# Altium schematic sheet Controller-RK3562-TOP.SchDoc
size A2; SheetNumber: 1; SheetTotal: 32
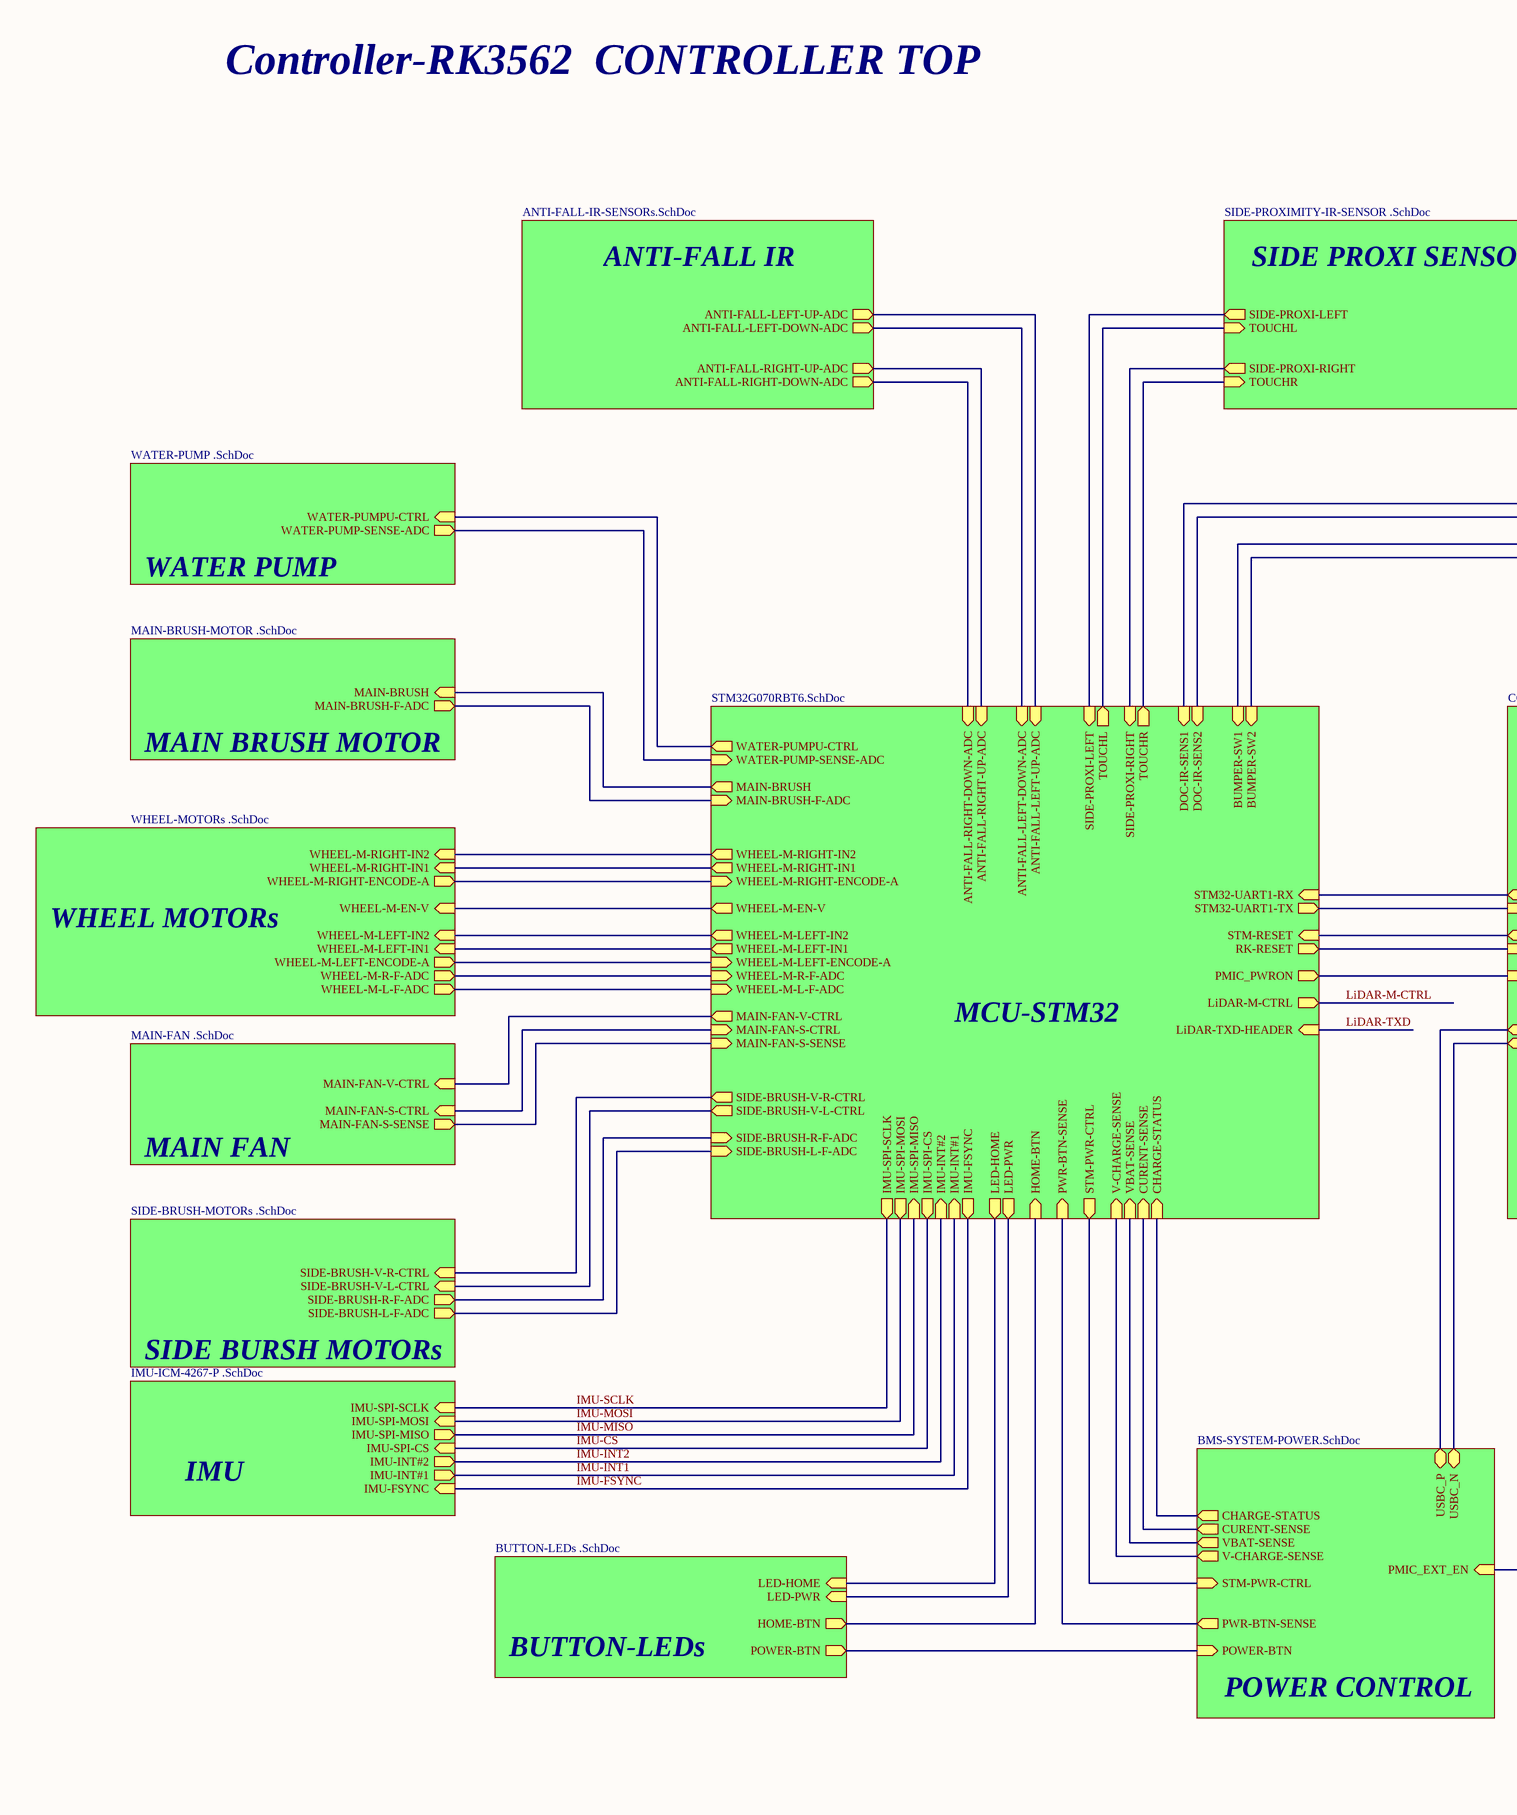
[diagram p0: Controller-RK3562-TOP.SchDoc, left]
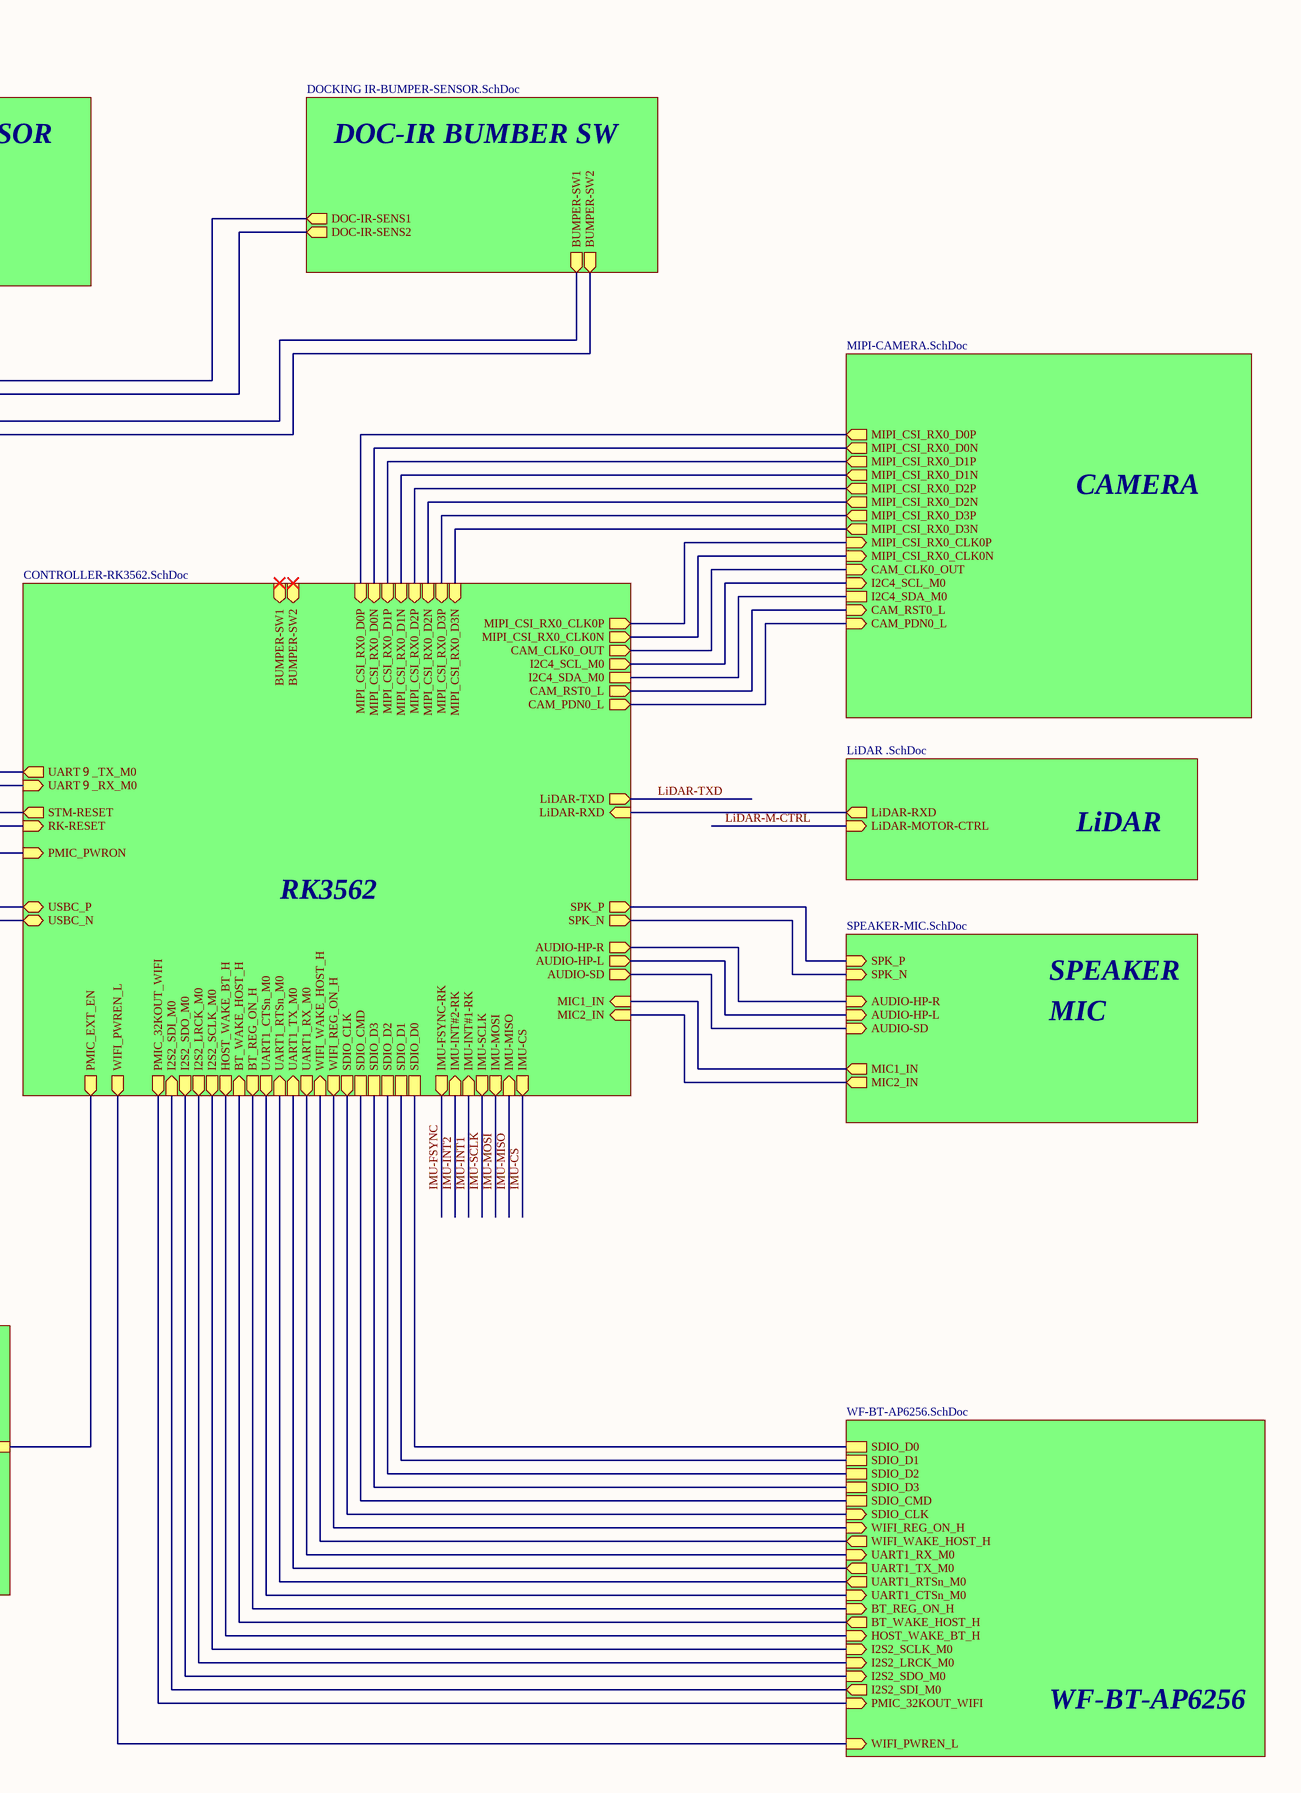
[diagram p1: Controller-RK3562-TOP.SchDoc, right]

## Sub-sheets
ANTI-FALL = ANTI-FALL-IR-SENSORs.SchDoc: ANTI-FALL-LEFT-UP-ADC (out), ANTI-FALL-LEFT-DOWN-ADC (out), ANTI-FALL-RIGHT-UP-ADC (out), ANTI-FALL-RIGHT-DOWN-ADC (out)
BUTTON-LED = BUTTON-LEDs .SchDoc: LED-HOME (in), LED-PWR (in), HOME-BTN (out), POWER-BTN (out)
CAMERA = MIPI-CAMERA.SchDoc: MIPI_CSI_RX0_D0P (out), MIPI_CSI_RX0_D0N (out), MIPI_CSI_RX0_D1P (out), MIPI_CSI_RX0_D1N (out), MIPI_CSI_RX0_D2P (out), MIPI_CSI_RX0_D2N (out), MIPI_CSI_RX0_D3P (out), MIPI_CSI_RX0_D3N (out), CAM_CLK0_OUT (in), I2C4_SCL_M0 (in), I2C4_SDA_M0, CAM_RST0_L (in), CAM_PDN0_L (in), MIPI_CSI_RX0_CLK0P (in), MIPI_CSI_RX0_CLK0N (in)
DOCKING-BUMBER = DOCKING IR-BUMPER-SENSOR.SchDoc: DOC-IR-SENS1 (out), DOC-IR-SENS2 (out), BUMPER-SW1 (out), BUMPER-SW2 (out)
IMU = IMU-ICM-4267-P .SchDoc: IMU-SPI-SCLK (in), IMU-SPI-MOSI (in), IMU-SPI-MISO (out), IMU-SPI-CS (in), IMU-INT#2 (out), IMU-INT#1 (out), IMU-FSYNC (in)
LiDAR = LiDAR .SchDoc: LiDAR-MOTOR-CTRL (in), LiDAR-RXD (out)
MAIN-BRUSH MOTOR = MAIN-BRUSH-MOTOR .SchDoc: MAIN-BRUSH (in), MAIN-BRUSH-F-ADC (out)
MAIN-FAN = MAIN-FAN .SchDoc: MAIN-FAN-V-CTRL (in), MAIN-FAN-S-CTRL (in), MAIN-FAN-S-SENSE (out)
MCU-STM32 = STM32G070RBT6.SchDoc: WATER-PUMPU-CTRL (out), MAIN-BRUSH (out), WHEEL-M-RIGHT-IN2 (out), WHEEL-M-RIGHT-IN1 (out), WHEEL-M-RIGHT-ENCODE-A (in), WHEEL-M-LEFT-IN2 (out), WHEEL-M-LEFT-IN1 (out), WHEEL-M-LEFT-ENCODE-A (in), WHEEL-M-EN-V (out), MAIN-FAN-V-CTRL (out), MAIN-FAN-S-CTRL (in), MAIN-FAN-S-SENSE (in), SIDE-BRUSH-V-R-CTRL (out), SIDE-BRUSH-V-L-CTRL (out), DOC-IR-SENS1 (in), DOC-IR-SENS2 (in), ANTI-FALL-LEFT-UP-ADC (in), ANTI-FALL-LEFT-DOWN-ADC (in), ANTI-FALL-RIGHT-UP-ADC (in), ANTI-FALL-RIGHT-DOWN-ADC (in), SIDE-PROXI-LEFT (in), TOUCHL (out), SIDE-PROXI-RIGHT (in), TOUCHR (out), LED-HOME (out), LED-PWR (out), HOME-BTN (in), CHARGE-STATUS (in), CURENT-SENSE (in), VBAT-SENSE (in), STM-RESET (in), STM32-UART1-TX (out), STM32-UART1-RX (in), WATER-PUMP-SENSE-ADC (in), MAIN-BRUSH-F-ADC (in), WHEEL-M-R-F-ADC (in), WHEEL-M-L-F-ADC (in), SIDE-BRUSH-R-F-ADC (in), SIDE-BRUSH-L-F-ADC (in), STM-PWR-CTRL (out), PWR-BTN-SENSE (in), PMIC_PWRON (out), RK-RESET (out), V-CHARGE-SENSE (in), LiDAR-M-CTRL (out), IMU-SPI-SCLK (out), IMU-SPI-MOSI (out), IMU-SPI-MISO (in), IMU-SPI-CS (out), IMU-INT#2 (in), IMU-INT#1 (in), IMU-FSYNC (out), LiDAR-TXD-HEADER (in), BUMPER-SW1 (in), BUMPER-SW2 (in)
POWER = BMS-SYSTEM-POWER.SchDoc: CHARGE-STATUS (out), CURENT-SENSE (out), VBAT-SENSE (out), POWER-BTN (in), USBC_P (bidir), USBC_N (bidir), PMIC_EXT_EN (in), STM-PWR-CTRL (in), PWR-BTN-SENSE (out), V-CHARGE-SENSE (out)
RK3562 = CONTROLLER-RK3562.SchDoc: MIPI_CSI_RX0_CLK0P (out), MIPI_CSI_RX0_CLK0N (out), I2C4_SCL_M0 (out), I2C4_SDA_M0, CAM_RST0_L (out), CAM_PDN0_L (out), MIPI_CSI_RX0_D3N (in), MIPI_CSI_RX0_D3P (in), MIPI_CSI_RX0_D2N (in), MIPI_CSI_RX0_D2P (in), MIPI_CSI_RX0_D1N (in), MIPI_CSI_RX0_D1P (in), MIPI_CSI_RX0_D0N (in), MIPI_CSI_RX0_D0P (in), CAM_CLK0_OUT (out), LiDAR-RXD (in), AUDIO-HP-L (out), AUDIO-SD (out), MIC1_IN (in), MIC2_IN (in), IMU-INT#1-RK (in), IMU-INT#2-RK (in), IMU-FSYNC-RK (out), SDIO_D0, SDIO_D1, SDIO_D2, SDIO_D3, SDIO_CMD, SDIO_CLK (out), WIFI_REG_ON_H (out), WIFI_WAKE_HOST_H (in), UART1_RX_M0 (out), UART1_TX_M0 (in), UART1_RTSn_M0 (in), UART1_CTSn_M0 (out), BT_REG_ON_H (out), BT_WAKE_HOST_H (in), HOST_WAKE_BT_H (out), I2S2_SCLK_M0 (out), I2S2_LRCK_M0 (out), I2S2_SDO_M0 (out), I2S2_SDI_M0 (in), PMIC_32KOUT_WIFI (out), WIFI_PWREN_L (out), PMIC_EXT_EN (out), PMIC_PWRON (in), USBC_N (bidir), USBC_P (bidir), UART９_RX_M0 (in), UART９_TX_M0 (out), STM-RESET (out), RK-RESET (in), BUMPER-SW1 (in), BUMPER-SW2 (in), IMU-SCLK (out), IMU-MOSI (out), IMU-MISO (in), IMU-CS (out), LiDAR-TXD (out), AUDIO-HP-R (out), SPK_P (out), SPK_N (out)
SIDE-BRUSH = SIDE-BRUSH-MOTORs .SchDoc: SIDE-BRUSH-V-R-CTRL (in), SIDE-BRUSH-V-L-CTRL (in), SIDE-BRUSH-R-F-ADC (out), SIDE-BRUSH-L-F-ADC (out)
SIDE-PROXI = SIDE-PROXIMITY-IR-SENSOR .SchDoc: SIDE-PROXI-LEFT (out), TOUCHL (in), SIDE-PROXI-RIGHT (out), TOUCHR (in)
SPEAKER-MIC = SPEAKER-MIC.SchDoc: AUDIO-HP-L (in), AUDIO-SD (in), MIC1_IN (out), MIC2_IN (out), AUDIO-HP-R (in), SPK_P (in), SPK_N (in)
WATER-PUMP = WATER-PUMP .SchDoc: WATER-PUMPU-CTRL (in), WATER-PUMP-SENSE-ADC (out)
WHEEL MOTOR = WHEEL-MOTORs .SchDoc: WHEEL-M-RIGHT-IN2 (in), WHEEL-M-RIGHT-IN1 (in), WHEEL-M-RIGHT-ENCODE-A (out), WHEEL-M-EN-V (in), WHEEL-M-LEFT-IN2 (in), WHEEL-M-LEFT-IN1 (in), WHEEL-M-LEFT-ENCODE-A (out), WHEEL-M-R-F-ADC (out), WHEEL-M-L-F-ADC (out)
WIFI-BT = WF-BT-AP6256.SchDoc: SDIO_D0, SDIO_D1, SDIO_D2, SDIO_D3, SDIO_CMD, SDIO_CLK (in), WIFI_REG_ON_H (in), WIFI_WAKE_HOST_H (out), UART1_RX_M0 (in), UART1_TX_M0 (out), UART1_RTSn_M0 (out), UART1_CTSn_M0 (in), BT_REG_ON_H (in), BT_WAKE_HOST_H (out), HOST_WAKE_BT_H (in), I2S2_SCLK_M0 (in), I2S2_LRCK_M0 (in), I2S2_SDO_M0 (in), I2S2_SDI_M0 (out), PMIC_32KOUT_WIFI (in), WIFI_PWREN_L (in)

## Nets
IMU-CS: sheet RK3562/IMU-CS, sheet MCU-STM32/IMU-SPI-CS, sheet IMU/IMU-SPI-CS
IMU-FSYNC: sheet RK3562/IMU-FSYNC-RK, sheet MCU-STM32/IMU-FSYNC, sheet IMU/IMU-FSYNC
IMU-INT1: sheet RK3562/IMU-INT#1-RK, sheet MCU-STM32/IMU-INT#1, sheet IMU/IMU-INT#1
IMU-INT2: sheet RK3562/IMU-INT#2-RK, sheet MCU-STM32/IMU-INT#2, sheet IMU/IMU-INT#2
IMU-MISO: sheet RK3562/IMU-MISO, sheet MCU-STM32/IMU-SPI-MISO, sheet IMU/IMU-SPI-MISO
IMU-MOSI: sheet RK3562/IMU-MOSI, sheet MCU-STM32/IMU-SPI-MOSI, sheet IMU/IMU-SPI-MOSI
IMU-SCLK: sheet RK3562/IMU-SCLK, sheet MCU-STM32/IMU-SPI-SCLK, sheet IMU/IMU-SPI-SCLK
LiDAR-M-CTRL: sheet LiDAR/LiDAR-MOTOR-CTRL, sheet MCU-STM32/LiDAR-M-CTRL
LiDAR-TXD: sheet RK3562/LiDAR-TXD, sheet MCU-STM32/LiDAR-TXD-HEADER
(unnamed): sheet RK3562/MIPI_CSI_RX0_CLK0P, sheet CAMERA/MIPI_CSI_RX0_CLK0P
(unnamed): sheet RK3562/MIPI_CSI_RX0_CLK0N, sheet CAMERA/MIPI_CSI_RX0_CLK0N
(unnamed): sheet RK3562/I2C4_SCL_M0, sheet CAMERA/I2C4_SCL_M0
(unnamed): sheet RK3562/I2C4_SDA_M0, sheet CAMERA/I2C4_SDA_M0
(unnamed): sheet RK3562/CAM_RST0_L, sheet CAMERA/CAM_RST0_L
(unnamed): sheet RK3562/CAM_PDN0_L, sheet CAMERA/CAM_PDN0_L
(unnamed): sheet RK3562/MIPI_CSI_RX0_D3N, sheet CAMERA/MIPI_CSI_RX0_D3N
(unnamed): sheet RK3562/MIPI_CSI_RX0_D3P, sheet CAMERA/MIPI_CSI_RX0_D3P
(unnamed): sheet RK3562/MIPI_CSI_RX0_D2N, sheet CAMERA/MIPI_CSI_RX0_D2N
(unnamed): sheet RK3562/MIPI_CSI_RX0_D2P, sheet CAMERA/MIPI_CSI_RX0_D2P
(unnamed): sheet RK3562/MIPI_CSI_RX0_D1N, sheet CAMERA/MIPI_CSI_RX0_D1N
(unnamed): sheet RK3562/MIPI_CSI_RX0_D1P, sheet CAMERA/MIPI_CSI_RX0_D1P
(unnamed): sheet RK3562/MIPI_CSI_RX0_D0N, sheet CAMERA/MIPI_CSI_RX0_D0N
(unnamed): sheet RK3562/MIPI_CSI_RX0_D0P, sheet CAMERA/MIPI_CSI_RX0_D0P
(unnamed): sheet RK3562/CAM_CLK0_OUT, sheet CAMERA/CAM_CLK0_OUT
(unnamed): sheet RK3562/LiDAR-RXD, sheet LiDAR/LiDAR-RXD
(unnamed): sheet RK3562/AUDIO-HP-L, sheet SPEAKER-MIC/AUDIO-HP-L
(unnamed): sheet RK3562/AUDIO-SD, sheet SPEAKER-MIC/AUDIO-SD
(unnamed): sheet RK3562/MIC1_IN, sheet SPEAKER-MIC/MIC1_IN
(unnamed): sheet RK3562/MIC2_IN, sheet SPEAKER-MIC/MIC2_IN
(unnamed): sheet RK3562/SDIO_D0, sheet WIFI-BT/SDIO_D0
(unnamed): sheet RK3562/SDIO_D1, sheet WIFI-BT/SDIO_D1
(unnamed): sheet RK3562/SDIO_D2, sheet WIFI-BT/SDIO_D2
(unnamed): sheet RK3562/SDIO_D3, sheet WIFI-BT/SDIO_D3
(unnamed): sheet RK3562/SDIO_CMD, sheet WIFI-BT/SDIO_CMD
(unnamed): sheet RK3562/SDIO_CLK, sheet WIFI-BT/SDIO_CLK
(unnamed): sheet RK3562/WIFI_REG_ON_H, sheet WIFI-BT/WIFI_REG_ON_H
(unnamed): sheet RK3562/WIFI_WAKE_HOST_H, sheet WIFI-BT/WIFI_WAKE_HOST_H
(unnamed): sheet RK3562/UART1_RX_M0, sheet WIFI-BT/UART1_RX_M0
(unnamed): sheet RK3562/UART1_TX_M0, sheet WIFI-BT/UART1_TX_M0
(unnamed): sheet RK3562/UART1_RTSn_M0, sheet WIFI-BT/UART1_RTSn_M0
(unnamed): sheet RK3562/UART1_CTSn_M0, sheet WIFI-BT/UART1_CTSn_M0
(unnamed): sheet RK3562/BT_REG_ON_H, sheet WIFI-BT/BT_REG_ON_H
(unnamed): sheet RK3562/BT_WAKE_HOST_H, sheet WIFI-BT/BT_WAKE_HOST_H
(unnamed): sheet RK3562/HOST_WAKE_BT_H, sheet WIFI-BT/HOST_WAKE_BT_H
(unnamed): sheet RK3562/I2S2_SCLK_M0, sheet WIFI-BT/I2S2_SCLK_M0
(unnamed): sheet RK3562/I2S2_LRCK_M0, sheet WIFI-BT/I2S2_LRCK_M0
(unnamed): sheet RK3562/I2S2_SDO_M0, sheet WIFI-BT/I2S2_SDO_M0
(unnamed): sheet RK3562/I2S2_SDI_M0, sheet WIFI-BT/I2S2_SDI_M0
(unnamed): sheet RK3562/PMIC_32KOUT_WIFI, sheet WIFI-BT/PMIC_32KOUT_WIFI
(unnamed): sheet RK3562/WIFI_PWREN_L, sheet WIFI-BT/WIFI_PWREN_L
(unnamed): sheet RK3562/PMIC_EXT_EN, sheet POWER/PMIC_EXT_EN
(unnamed): sheet RK3562/PMIC_PWRON, sheet MCU-STM32/PMIC_PWRON
(unnamed): sheet RK3562/USBC_N, sheet POWER/USBC_N
(unnamed): sheet RK3562/USBC_P, sheet POWER/USBC_P
(unnamed): sheet RK3562/UART９_RX_M0, sheet MCU-STM32/STM32-UART1-TX
(unnamed): sheet RK3562/UART９_TX_M0, sheet MCU-STM32/STM32-UART1-RX
(unnamed): sheet RK3562/STM-RESET, sheet MCU-STM32/STM-RESET
(unnamed): sheet RK3562/RK-RESET, sheet MCU-STM32/RK-RESET
(unnamed): sheet RK3562/AUDIO-HP-R, sheet SPEAKER-MIC/AUDIO-HP-R
(unnamed): sheet RK3562/SPK_P, sheet SPEAKER-MIC/SPK_P
(unnamed): sheet RK3562/SPK_N, sheet SPEAKER-MIC/SPK_N
(unnamed): sheet POWER/CHARGE-STATUS, sheet MCU-STM32/CHARGE-STATUS
(unnamed): sheet POWER/CURENT-SENSE, sheet MCU-STM32/CURENT-SENSE
(unnamed): sheet POWER/VBAT-SENSE, sheet MCU-STM32/VBAT-SENSE
(unnamed): sheet POWER/POWER-BTN, sheet BUTTON-LED/POWER-BTN
(unnamed): sheet POWER/STM-PWR-CTRL, sheet MCU-STM32/STM-PWR-CTRL
(unnamed): sheet POWER/PWR-BTN-SENSE, sheet MCU-STM32/PWR-BTN-SENSE
(unnamed): sheet POWER/V-CHARGE-SENSE, sheet MCU-STM32/V-CHARGE-SENSE
(unnamed): sheet DOCKING-BUMBER/DOC-IR-SENS1, sheet MCU-STM32/DOC-IR-SENS1
(unnamed): sheet DOCKING-BUMBER/DOC-IR-SENS2, sheet MCU-STM32/DOC-IR-SENS2
(unnamed): sheet DOCKING-BUMBER/BUMPER-SW1, sheet MCU-STM32/BUMPER-SW1
(unnamed): sheet DOCKING-BUMBER/BUMPER-SW2, sheet MCU-STM32/BUMPER-SW2
(unnamed): sheet ANTI-FALL/ANTI-FALL-LEFT-UP-ADC, sheet MCU-STM32/ANTI-FALL-LEFT-UP-ADC
(unnamed): sheet ANTI-FALL/ANTI-FALL-LEFT-DOWN-ADC, sheet MCU-STM32/ANTI-FALL-LEFT-DOWN-ADC
(unnamed): sheet ANTI-FALL/ANTI-FALL-RIGHT-UP-ADC, sheet MCU-STM32/ANTI-FALL-RIGHT-UP-ADC
(unnamed): sheet ANTI-FALL/ANTI-FALL-RIGHT-DOWN-ADC, sheet MCU-STM32/ANTI-FALL-RIGHT-DOWN-ADC
(unnamed): sheet SIDE-PROXI/SIDE-PROXI-LEFT, sheet MCU-STM32/SIDE-PROXI-LEFT
(unnamed): sheet SIDE-PROXI/TOUCHL, sheet MCU-STM32/TOUCHL
(unnamed): sheet SIDE-PROXI/SIDE-PROXI-RIGHT, sheet MCU-STM32/SIDE-PROXI-RIGHT
(unnamed): sheet SIDE-PROXI/TOUCHR, sheet MCU-STM32/TOUCHR
(unnamed): sheet WATER-PUMP/WATER-PUMPU-CTRL, sheet MCU-STM32/WATER-PUMPU-CTRL
(unnamed): sheet WATER-PUMP/WATER-PUMP-SENSE-ADC, sheet MCU-STM32/WATER-PUMP-SENSE-ADC
(unnamed): sheet MAIN-BRUSH MOTOR/MAIN-BRUSH, sheet MCU-STM32/MAIN-BRUSH
(unnamed): sheet MAIN-BRUSH MOTOR/MAIN-BRUSH-F-ADC, sheet MCU-STM32/MAIN-BRUSH-F-ADC
(unnamed): sheet WHEEL MOTOR/WHEEL-M-RIGHT-IN2, sheet MCU-STM32/WHEEL-M-RIGHT-IN2
(unnamed): sheet WHEEL MOTOR/WHEEL-M-RIGHT-IN1, sheet MCU-STM32/WHEEL-M-RIGHT-IN1
(unnamed): sheet WHEEL MOTOR/WHEEL-M-RIGHT-ENCODE-A, sheet MCU-STM32/WHEEL-M-RIGHT-ENCODE-A
(unnamed): sheet WHEEL MOTOR/WHEEL-M-EN-V, sheet MCU-STM32/WHEEL-M-EN-V
(unnamed): sheet WHEEL MOTOR/WHEEL-M-LEFT-IN2, sheet MCU-STM32/WHEEL-M-LEFT-IN2
(unnamed): sheet WHEEL MOTOR/WHEEL-M-LEFT-IN1, sheet MCU-STM32/WHEEL-M-LEFT-IN1
(unnamed): sheet WHEEL MOTOR/WHEEL-M-LEFT-ENCODE-A, sheet MCU-STM32/WHEEL-M-LEFT-ENCODE-A
(unnamed): sheet WHEEL MOTOR/WHEEL-M-R-F-ADC, sheet MCU-STM32/WHEEL-M-R-F-ADC
(unnamed): sheet WHEEL MOTOR/WHEEL-M-L-F-ADC, sheet MCU-STM32/WHEEL-M-L-F-ADC
(unnamed): sheet MAIN-FAN/MAIN-FAN-V-CTRL, sheet MCU-STM32/MAIN-FAN-V-CTRL
(unnamed): sheet MAIN-FAN/MAIN-FAN-S-CTRL, sheet MCU-STM32/MAIN-FAN-S-CTRL
(unnamed): sheet MAIN-FAN/MAIN-FAN-S-SENSE, sheet MCU-STM32/MAIN-FAN-S-SENSE
(unnamed): sheet SIDE-BRUSH/SIDE-BRUSH-V-R-CTRL, sheet MCU-STM32/SIDE-BRUSH-V-R-CTRL
(unnamed): sheet SIDE-BRUSH/SIDE-BRUSH-V-L-CTRL, sheet MCU-STM32/SIDE-BRUSH-V-L-CTRL
(unnamed): sheet SIDE-BRUSH/SIDE-BRUSH-R-F-ADC, sheet MCU-STM32/SIDE-BRUSH-R-F-ADC
(unnamed): sheet SIDE-BRUSH/SIDE-BRUSH-L-F-ADC, sheet MCU-STM32/SIDE-BRUSH-L-F-ADC
(unnamed): sheet BUTTON-LED/LED-HOME, sheet MCU-STM32/LED-HOME
(unnamed): sheet BUTTON-LED/LED-PWR, sheet MCU-STM32/LED-PWR
(unnamed): sheet BUTTON-LED/HOME-BTN, sheet MCU-STM32/HOME-BTN

## Notes on the sheet
- Controller-RK3562  CONTROLLER TOP
- ANTI-FALL IR
- SIDE PROXI SENSOR
- DOC-IR BUMBER SW
- WATER PUMP
- CAMERA
- MAIN BRUSH MOTOR
- WHEEL MOTORs
- LiDAR
- MCU-STM32
- RK3562
- MAIN FAN
- SPEAKER
- MIC
- SIDE BURSH MOTORs
- IMU
- BUTTON-LEDs
- POWER CONTROL
- WF-BT-AP6256